# EAGLE schematic V0p2_Main_PCB2 (EAGLE 6.4)
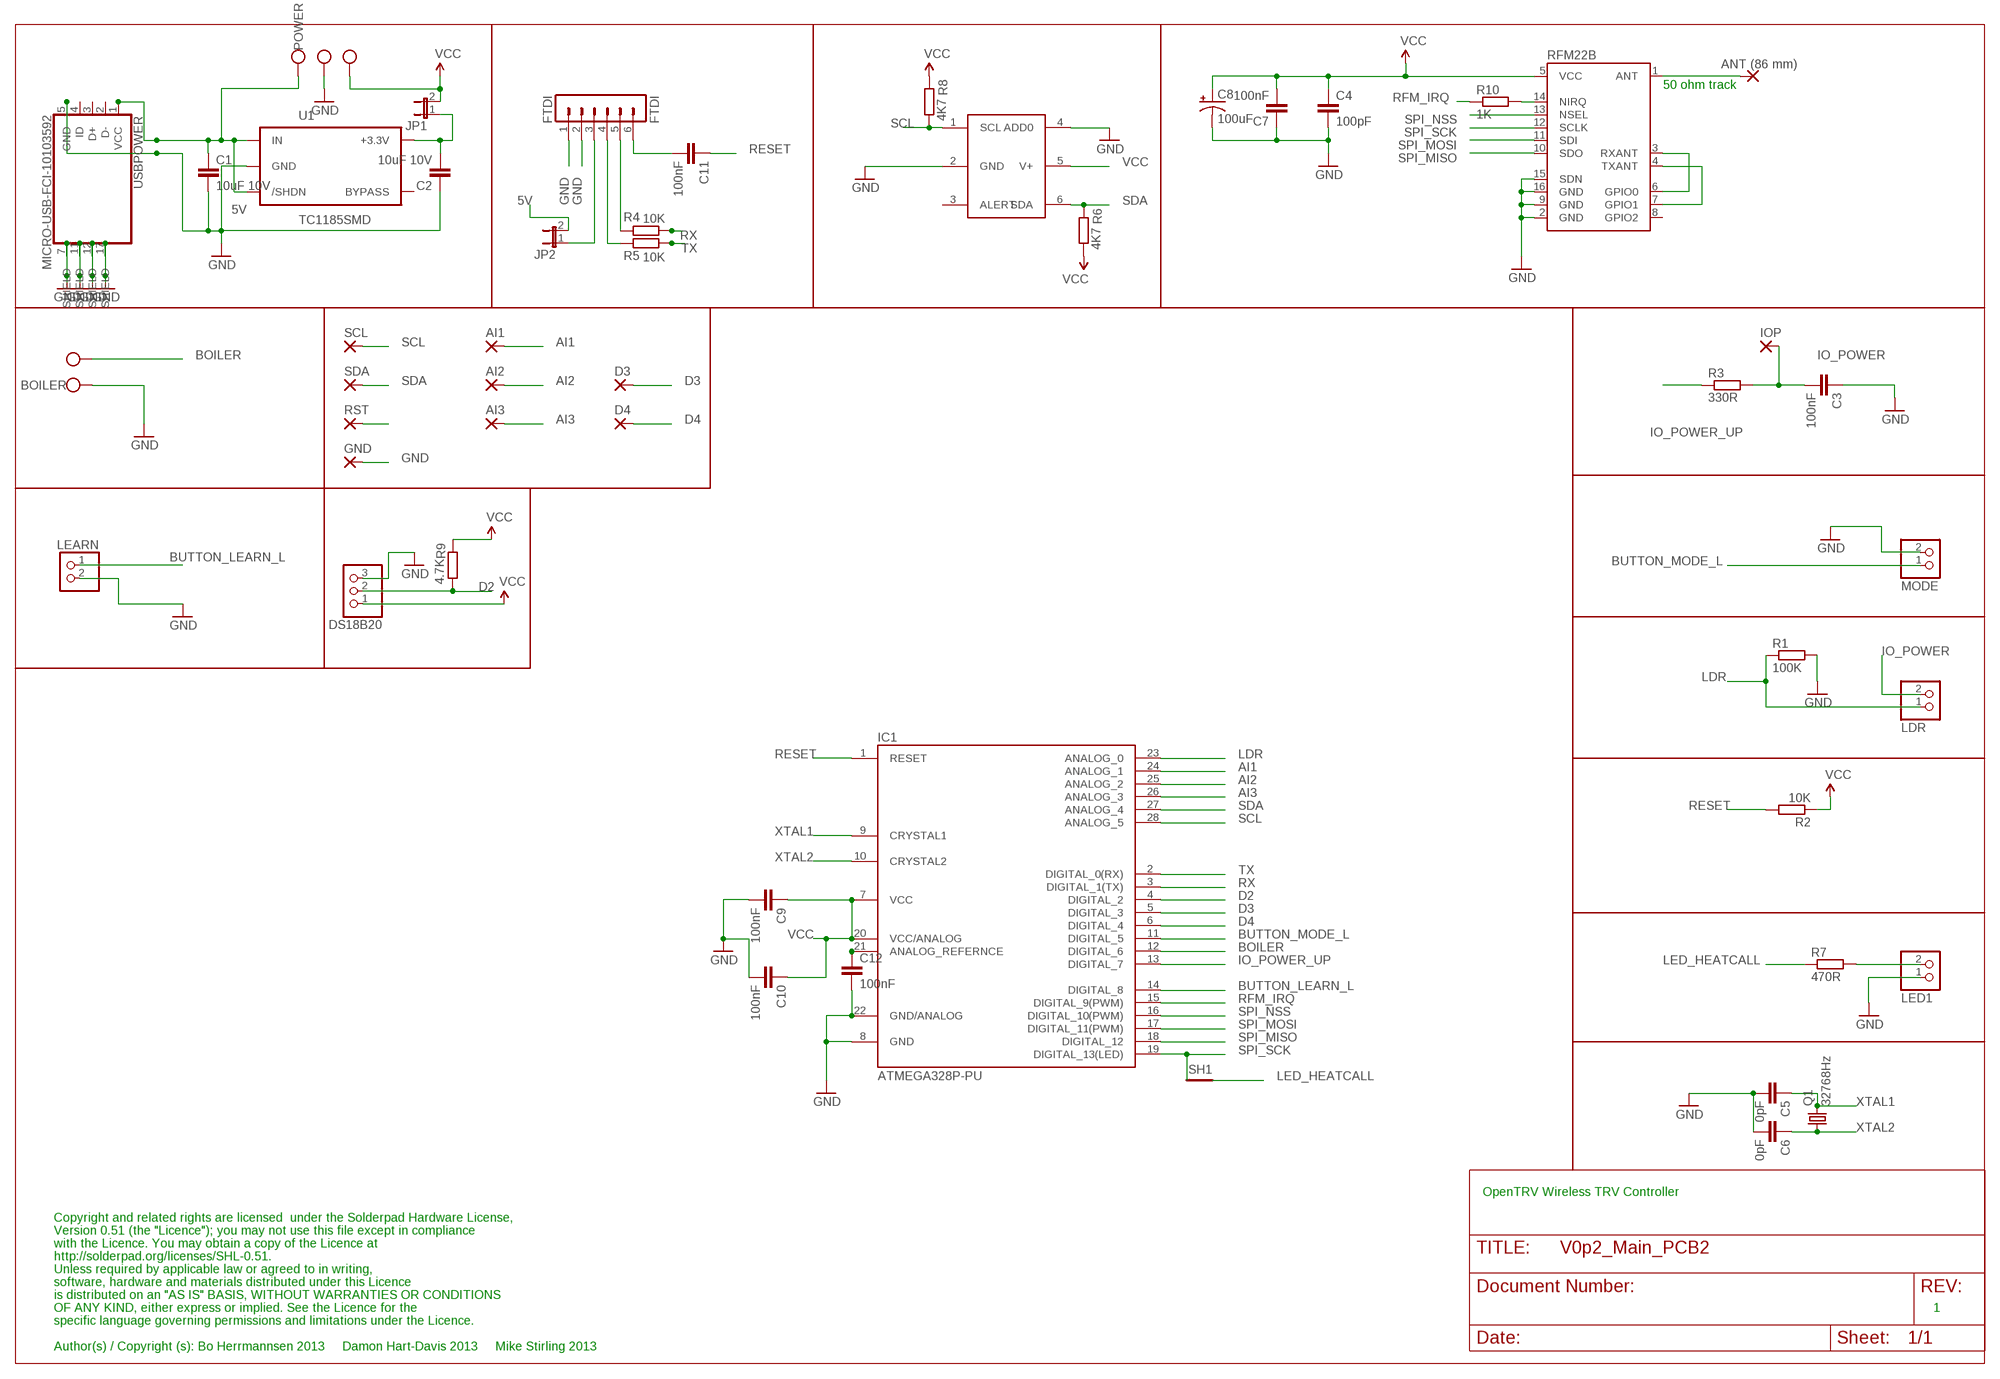
[diagram p0: schematic, sheet 1]

## Parts
AI1  2,15/1,0  [2,15/1,0]
AI2  2,15/1,0  [2,15/1,0]
AI3  2,15/1,0  [2,15/1,0]
ANT  ANT (86 mm)  2,15/1,0  [2,15/1,0]
BOILER  W237-102  [SCREWTERMINAL]
C1  10uF 10V  CAP0603-CAP  [0603-CAP]
C2  10uF 10V  CAP0603-CAP  [0603-CAP]
C3  100nF  CAP0603-CAP  [0603-CAP]
C4  100pF  CAP0603-CAP  [0603-CAP]
C5  0pF  CAP0603-CAP  [0603-CAP]
C6  0pF  CAP0603-CAP  [0603-CAP]
C7  100nF  CAP0603-CAP  [0603-CAP]
C8  100uF  CAP_POL1206  [EIA3216]
C9  100nF  CAP0603-CAP  [0603-CAP]
C10  100nF  CAP0603-CAP  [0603-CAP]
C11  100nF  CAP0603-CAP  [0603-CAP]
C12  100nF  CAP0603-CAP  [0603-CAP]
D3  2,15/1,0  [2,15/1,0]
D4  2,15/1,0  [2,15/1,0]
DS18B20  PINHD-1X3  [1X03]
FTDI  FTDI  MA06-1  [MA06-1]
GND  2,15/1,0  [2,15/1,0]
IC1  ATMEGA328P-PU  ATMEGA8-PU  [DIL28-3]
IOP  2,15/1,0  [2,15/1,0]
JP1  JP1E  [JP1]
JP2  JP1E  [JP1]
LDR  PINHD-1X2  [1X02]
LEARN  PINHD-1X2  [1X02]
LED1  PINHD-1X2  [1X02]
MODE  PINHD-1X2  [1X02]
POWER  W237-102  [SCREWTERMINAL]
Q1  32768Hz  MC-306  [MC-306]
R1  100K  R-EU_R0603  [R0603]
R2  10K  R-EU_R0603  [R0603]
R3  330R  R-EU_R0603  [R0603]
R4  10K  R-EU_R0603  [R0603]
R5  10K  R-EU_R0603  [R0603]
R6  4K7  R-EU_R0603  [R0603]
R7  470R  R-EU_R0603  [R0603]
R8  4K7  R-EU_R0603  [R0603]
R9  4.7K  R-EU_R0603  [R0603]
R10  1K  R-EU_R0603  [R0603]
RFM22B  RFM22SMD  [RFM22-XXX-S2]
RST  2,15/1,0  [2,15/1,0]
SCL  2,15/1,0  [2,15/1,0]
SDA  2,15/1,0  [2,15/1,0]
SH1  SHORT-HT5  [SHORT_TOP-50]
TMP  TMP112  [TMP112]
U1  TC1185SMD  [TC1185]
USBPOWER  MICRO-USB-FCI-10103592  [MICRO-USB-FCI-10103592]

## Nets
5V [supply]: C1.1 JP2.2 POWER.1(KL) U1.1(IN) U1.3(/SHDN) USBPOWER.1(VCC)
AI1: AI1.1(P) IC1.24(ANALOG_1)
AI2: AI2.1(P) IC1.25(ANALOG_2)
AI3: AI3.1(P) IC1.26(ANALOG_3)
BOILER: BOILER.2(KL1) IC1.12(DIGITAL_6)
BUTTON_LEARN_L: IC1.14(DIGITAL_8) LEARN.1
BUTTON_MODE_L: IC1.11(DIGITAL_5) MODE.1
D2: DS18B20.2 IC1.4(DIGITAL_2) R9.1
D3: D3.1(P) IC1.5(DIGITAL_3)
D4: D4.1(P) IC1.6(DIGITAL_4)
GND [tmp]: BOILER.1(KL) C1.2 C2.1 C3.1 C4.2 C5.2 C6.2 C7.1 C8.C(-) C9.2 C10.2 C12.2 DS18B20.3 FTDI.1(GND) FTDI.2(CTS) GND.1(P) IC1.8(GND) IC1.22(GND/ANALOG) LEARN.2 LED1.1 MODE.2 POWER.2(KL1) R1.2 RFM22B.2(GND) RFM22B.9(GND) RFM22B.15(SDN) RFM22B.16(GND) RST.1(P) TMP.2(GND) TMP.4(ADD0) U1.2(GND) USBPOWER.5(GND) USBPOWER.7(SHIELD) USBPOWER.11(SHIELD) USBPOWER.12(SHIELD) USBPOWER.17(SHIELD)
IO_POWER [supply]: C3.2 IOP.1(P) LDR.2 R3.2
IO_POWER_UP [supply]: IC1.13(DIGITAL_7) R3.1
LDR: IC1.23(ANALOG_0) LDR.1 R1.1
LED_HEATCALL: R7.1 SH1.2
LEDEXT: LED1.2 R7.2
N$1: C11.2 FTDI.6(RTS)
N$3: FTDI.4(TX) R5.2
N$5: FTDI.5(RX) R4.2
N$6 [supply]: C12.1 IC1.21(ANALOG_REFERNCE)
N$7: R10.2 RFM22B.14(NIRQ)
N$8 [supply]: C2.2 JP1.1 U1.5(+3.3V)
N$11: FTDI.3(VCC) JP2.1
N$20: RFM22B.3(RXANT) RFM22B.6(GPIO0)
N$21: RFM22B.4(TXANT) RFM22B.7(GPIO1)
N$26 [ant]: ANT.1(P) RFM22B.1(ANT)
RESET: C11.1 IC1.1(RESET) R2.2
RFM_IRQ: IC1.15(DIGITAL_9(PWM)) R10.1
RX: IC1.3(DIGITAL_1(TX)) R4.1
SCL [tmp]: IC1.28(ANALOG_5) R8.1 SCL.1(P) TMP.1(SCL)
SDA: IC1.27(ANALOG_4) R6.2 SDA.1(P) TMP.6(SDA)
SPI_MISO: IC1.18(DIGITAL_12) RFM22B.10(SDO)
SPI_MOSI: IC1.17(DIGITAL_11(PWM)) RFM22B.11(SDI)
SPI_NSS: IC1.16(DIGITAL_10(PWM)) RFM22B.13(NSEL)
SPI_SCK: IC1.19(DIGITAL_13(LED)) RFM22B.12(SCLK) SH1.1
TX: IC1.2(DIGITAL_0(RX)) R5.1
VCC [supply]: C4.1 C7.2 C8.A(+) C9.1 C10.1 DS18B20.1 IC1.7(VCC) IC1.20(VCC/ANALOG) JP1.2 POWER.3(KL2) R2.1 R6.1 R8.2 R9.2 RFM22B.5(VCC) TMP.5(V+)
XTAL1: C5.1 IC1.9(CRYSTAL1) Q1.4
XTAL2: C6.1 IC1.10(CRYSTAL2) Q1.1
Unconnected: RFM22B.8(GPIO2) TMP.3(ALERT) U1.4(BYPASS) USBPOWER.2(D-) USBPOWER.3(D+) USBPOWER.4(ID)

## Notes on the sheet
- 50 ohm track
- OpenTRV Wireless TRV Controller
- Copyright and related rights are licensed  under the Solderpad Hardware License,
- Version 0.51 (the "Licence"); you may not use this file except in compliance
- with the Licence. You may obtain a copy of the Licence at
- http://solderpad.org/licenses/SHL-0.51.
- Unless required by applicable law or agreed to in writing,
- software, hardware and materials distributed under this Licence
- is distributed on an "AS IS" BASIS, WITHOUT WARRANTIES OR CONDITIONS
- OF ANY KIND, either express or implied. See the Licence for the | 1
- specific language governing permissions and limitations under the Licence.
- Author(s) / Copyright (s): Bo Herrmannsen 2013     Damon Hart-Davis 2013     Mike Stirling 2013

## Library data of the parts
AI1-AI3 ANT D3 D4 GND IOP RST SCL SDA = wirepad:2,15/1,0: THROUGH-HOLE PAD
BOILER = screwterminal_new:W237-102: WAGO SCREW CLAMP
C1-C7 C9-C12 = SparkFun-Passives:CAP: Capacitor Standard 0603 ceramic capacitor, and 0.1" leaded capacitor.
C8 = SparkFun-Passives:CAP_POL: Capacitor Polarized These are standard SMD and PTH capacitors. Normally 10uF, 47uF, and 100uF in electrolytic and tantalum varieties. Always verify the external diameter of the through hole cap, it varies with capacity, voltage, and manufacturer. The EIA devices should be standard.
DS18B20 = pinhead:PINHD-1X3: PIN HEADER
FTDI = FTDI:MA06-1: PIN HEADER; OC_FARNELL: unknown; OC_NEWARK: unknown
IC1 = Arduino-AVR:ATMEGA8-PU
JP1 JP2 = jumper:JP1E: JUMPER
LDR LEARN LED1 MODE = pinhead:PINHD-1X2: PIN HEADER
POWER = screwterminal3_new:W237-102: WAGO SCREW CLAMP
Q1 = crystal:MC-306: kHz RANGE CRYSTAL UNIT SMD Source: MC-306_405_406_E07X.PDF Homepage <http://www.epsontoyocom.co.jp>; MPN: MC-306 60.0KHZ 100PPM ,12.5PF; OC_FARNELL: 1278040; OC_NEWARK: 31M5576
R1-R10 = resistor:R-EU_: RESISTOR, European symbol
RFM22B = SparkFun-RF:RFM22: The RFM22 is a low-power, low cost radio that is capable of operating in the 434MHz and 900MHz open bands. It's frequency is software defined and there are some very good libraries written for it.
SH1 = shorts:SHORT-H: Short between two nets; BOM: no
TMP = TMP112:TMP112
U1 = 3.3VREG:TC1185
USBPOWER = micro-usb-fci-10103592:MICRO-USB-FCI-10103592: Micro USB B Connector RS No: 714-2334 MRF No: 10103592-0001LF

## Net classes
0 default: width 0.305 mm
1 supply: width 0.406 mm, clearance 0.203 mm
2 mains: width 1.626 mm, clearance 4.064 mm
3 ant: width 2.184 mm
4 tmp: width 0.152 mm